# EAGLE design Final_v2 (EAGLE 8.6.3)
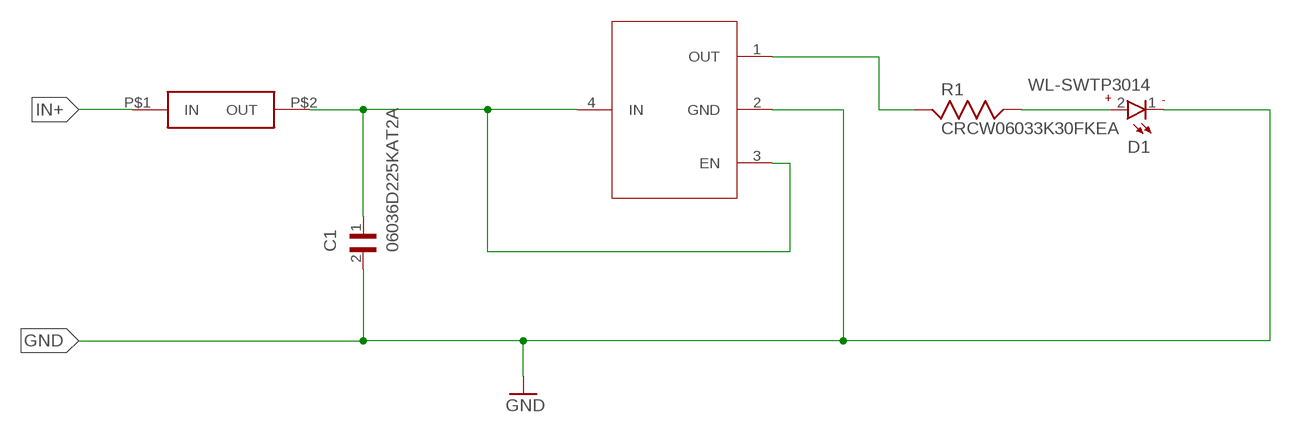
[diagram p0: schematic, sheet 1]

## Parts
C1  06036D225KAT2A  [CAPC1608X90]
D1  WL-SWTP3014  [WL-SWTP_3014]
R1  CRCW06033K30FKEA  [RESC1608X55]
U$2  SCHOTTKY0402  [0402_MURATA]
U$3  NCP161_711AJ  [REG_NCP160AMX180TBG]

## Nets
GND: C1.2 D1.1 U$3.2(GND)
IN: C1.1 U$2.P$2(OUT) U$3.3(EN) U$3.4(IN)
IN+: U$2.P$1(IN)
N$2: D1.2 R1.2
OUT: R1.1 U$3.1(OUT)

## Library data of the parts
C1 = Capacitor_2.2uF_0603:06036D225KAT2A: Cap Ceramic 2.2uF 6.3V X5R 10% SMD 0603 85°C Paper T/R; DESCRIPTION: 0603 2.2 uF 6.3 V ±10 % Tolerance X5R Surface Mount Multilayer Ceramic Capacitor; DIGI-KEY_PART_NUMBER: 478-1252-1-ND; DIGI-KEY_PURCHASE_URL: https://www.digikey.co.uk/product-detail/en/avx-corporation/06036D225KAT2A/478-1252-1-ND/564284?utm_source=snapeda&utm_medium=aggregator&utm_campaign=symbol; MF: AVX; MP: 06036D225KAT2A; PACKAGE: 0603 AVX
D1 = WL-SWTP:WL-SWTP: WL-SWTP SMD White Top view PLCC LED Size 3014, PLCC2 Characteristics Fast switching No IR radiation High CRI Slim and miniature size Low power consumption Suitable for all SMT assembly methods Top view Wide viewing angle Various color temperatures Thermal resistance junction to solder point: 38 °K/W LED junction temperature: 130 °C Efficacy typ. 128 Im/W @ 5000 °K Applications Signal lights Indoor displays Backlights General illumination,industrial and commercial lighting systems Replacement for PLCC 3528 in T8/T5 <http://katalog.we-online.de/media/images/eipal/WL-SWTP_pf2.jpg> Details see: http://katalog.we-online.de/en/led/WL-SWTP/158301260?m Creation Date: 2015-01-06, 2015 (C) Wurth Elektronik; DESCRIPTION: SMD LED PLCC2 Daylight white 120 ° 3.2 V Wuerth Elektronik; DIGI-KEY_PART_NUMBER: 732-5661-1-ND; DIGI-KEY_PURCHASE_URL: https://www.digikey.co.uk/product-detail/en/wurth-electronics-inc/158301250/732-5661-1-ND/4947879?utm_source=snapeda&utm_medium=aggregator&utm_campaign=symbol; MF: Wurth Electronics; MP: 158301250; PACKAGE: 1206 Würth Elektronik
R1 = CRCW06033K30FKEA:CRCW06033K30FKEA: Res Thick Film 0603 3.3K Ohm 1% 0.1W(1/10W) ?100ppm/C SMD Automotive Paper T/R; DESCRIPTION: Res Thick Film 0603 3.3K Ohm 1% 0.1W_1/10W_ ?100ppm/C SMD Automotive Paper T/R; DIGI-KEY_PART_NUMBER: 541-3.30KHCT-ND; DIGI-KEY_PURCHASE_URL: https://www.digikey.com/product-detail/en/vishay-dale/CRCW06033K30FKEA/541-3.30KHCT-ND/1179866?utm_source=snapeda&utm_medium=aggregator&utm_campaign=symbol; MF: Vishay Dale; MP: CRCW06033K30FKEA; PACKAGE: 0603 Vishay
U$2 = Schottki_0402:SCHOTTKY0402
U$3 = NCP160AMX180TBG:NCP161_711AJ

## Board
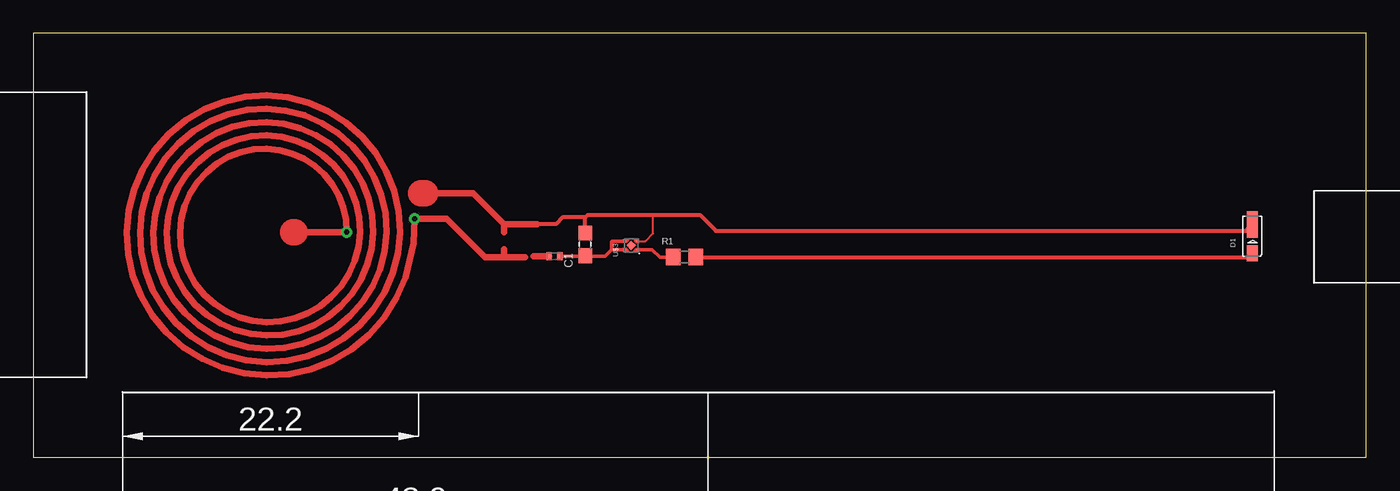
[diagram p1: board, top side]

Size 100 x 31.81 mm. Coordinates in mm from the lower left corner, seen from the top.
Outline: 0,0 100,0 100,31.81 0,31.81 0,0
Copper layers (1*16): Top 0.035mm / dielectric 1.5mm / Bottom 0.035mm
Design rules "default": minimum track width 6mil, minimum drill 0.35mm, track to track 6mil, track to pad 6mil, pad to pad 6mil, via to via 6mil, smd to smd 6mil, copper to edge 40mil, drill to drill 6mil, minimum pad ring 10mil, minimum via ring 8mil, stop-mask expansion 4mil, vias tented up to drill 0mil, thermal gap 10mil

### Footprints (pad centres in the part's own frame; a part is rotated, then mirrored left to right if it is on the bottom)
CAPC1608X90 = smd 1.1 x 1: 1 -0.85,0; 2 0.85,0
WL-SWTP_3014 = smd 2 x 0.8: 1 0.88,0 | smd 1.2 x 0.8: 2 -1.27,0
RESC1608X55 = smd 1.1 x 1.25: 1 -0.85,0; 2 0.85,0
0402_MURATA = smd 0.4 x 0.6: P$1 -0.4,0; P$2 0.4,0
REG_NCP160AMX180TBG = smd 0.1 x 0.1: 1 -0.325,-0.4; 2 0.325,-0.4; 3 0.325,0.4; 4 -0.325,0.4 | smd 0.52 x 0.52 rotated 45: 5 0,0

### Placement (x,y rotation side)
C1  41.4,15.98 90 top
D1  91.46,16.6 90 top
R1  48.86,15.03 0 top
U$2  39.09,15.09 0 top
U$3  44.86,15.9 90 top

### Tracks (layer width: path | path; a pad name or v marks a point on that pad's centre or on a via)
GND
  Top 0.152: U$3.2 45.92,16.23 46.5,16.8 46.5,18.2
  Top 0.305: 41.4,18 41.6,18.2 46.5,18.2 50,18.2 51.2,17 90.98,17 D1.1 91.5,17.52 | C1.2 41.4,18 | 41.4,18 39.7,18 39.2,17.5 37.8,17.5
  Top 0.5: 37.8,17.5 35.3,17.5 | 35.3,17.5 33,19.8 29.4,19.8 | 35.3,17.5 35.3,16.9
  Top 2: 29.1,19.8 29.4,19.8
IN
  Top 0.152: 41.36,15.09 C1.1
  Top 0.254: U$3.4 43.38,15.57 | 43.38,15.57 42.89,15.09 41.36,15.09 U$2.P$2 | U$3.3 43.42,16.23 43.38,16.18 43.38,15.57
IN+
  Top 0.5: U$2.P$1 37.54,15.09 37.53,15.1
N$2
  Top 0.305: R1.2 91.16,15.03 D1.2
N$4  (via drill 0.4 pad 0.5)
  Top 0.5: 19.6,16.9 v23.5,16.9 23.45,17.84 23.25,18.77 22.91,19.66 22.43,20.48 21.83,21.23 21.11,21.88 20.3,22.4 19.42,22.8 18.47,23.05 17.5,23.15 16.52,23.1 15.55,22.89 14.63,22.54 13.77,22.04 12.99,21.41 12.32,20.66 11.78,19.82 11.37,18.89 11.11,17.91 11,16.9 11.05,15.88 11.27,14.88 11.64,13.91 12.16,13.02 12.81,12.21 13.59,11.52 14.47,10.95 15.43,10.53 16.45,10.26 17.5,10.15 18.56,10.21 19.6,10.43 20.6,10.82 21.53,11.36 22.36,12.04 23.08,12.84 23.67,13.76 24.11,14.75 24.39,15.81 24.5,16.9 24.44,18 24.2,19.08 23.8,20.11 23.24,21.07 22.54,21.94 21.7,22.68 20.76,23.29 19.73,23.75 18.63,24.04 17.5,24.15 16.36,24.09 15.24,23.84 14.18,23.43 13.18,22.85 12.29,22.11 11.51,21.25 10.88,20.27 10.41,19.2 10.12,18.07 10,16.9 10.07,15.72 10.32,14.57 10.75,13.46 11.35,12.43 12.11,11.51 13,10.71 14.02,10.06 15.12,9.58 16.29,9.27 17.5,9.15 18.72,9.22 19.91,9.48 21.05,9.93 22.11,10.55 23.07,11.33 23.89,12.26 24.56,13.3 25.06,14.44 25.38,15.65 25.5,16.9 25.43,18.16 25.16,19.39 24.7,20.57 24.05,21.66 23.25,22.64 22.29,23.49 21.21,24.18 20.03,24.7 18.79,25.02 17.5,25.15 16.21,25.07 14.94,24.79 13.72,24.32 12.59,23.66 11.58,22.82 10.7,21.84 9.99,20.73 9.46,19.51 9.13,18.23 9,16.9 9.08,15.57 9.37,14.26 9.86,13.01 10.54,11.85 11.4,10.8 12.42,9.9 13.56,9.17 14.81,8.63 16.14,8.28 17.5,8.15 18.87,8.23 20.22,8.53 21.51,9.04 22.7,9.74 23.78,10.62 24.7,11.67 25.45,12.85 26.01,14.13 26.36,15.5 26.5,16.9 26.41,18.31 26.11,19.7 25.59,21.02 24.86,22.25 23.95,23.35 22.88,24.3 21.66,25.07 20.34,25.65 18.94,26.01 17.5,26.15 16.05,26.06 14.63,25.75 13.27,25.21 12,24.46 10.87,23.53 9.89,22.43 9.1,21.18 8.51,19.82 8.14,18.38 8,16.9 8.09,15.41 8.42,13.95 8.97,12.55 9.73,11.26 10.69,10.09 11.83,9.09 13.11,8.28 14.5,7.67 15.98,7.29 17.5,7.15 19.03,7.25 20.53,7.58 21.96,8.15 23.29,8.93 24.48,9.92 25.51,11.08 26.34,12.39 26.96,13.82 27.35,15.34 27.5,16.9 27.4,18.47 27.06,20.01 26.48,21.47 25.67,22.84 24.66,24.06 23.47,25.11 22.12,25.97 20.65,26.6 19.1,27 17.5,27.15 15.89,27.05 14.32,26.7 12.81,26.1 11.42,25.27 10.16,24.24 9.09,23.01 8.21,21.63 7.56,20.13 7.15,18.54 7,16.9 7.11,15.25 7.47,13.64 8.08,12.1 8.92,10.67 9.99,9.39 11.24,8.28 12.65,7.39 14.19,6.72 15.82,6.31 17.5,6.15 19.19,6.26 20.84,6.63 22.41,7.25 23.88,8.12 25.19,9.21 26.32,10.49 27.23,11.94 27.91,13.52 28.54,16.08 v28.6,17.9 31,17.9 33.9,15 35.3,15
  Top 0.5: 35.3,15 36.88,15 | 35.3,15 35.3,15.6
  Top 2: 19.6,16.9 19.5,16.9
OUT
  Top 0.254: U$3.1 46.42,15.57 47,15 47.98,15 R1.1